# EAGLE design sensor-pod (EAGLE 9.6.2)
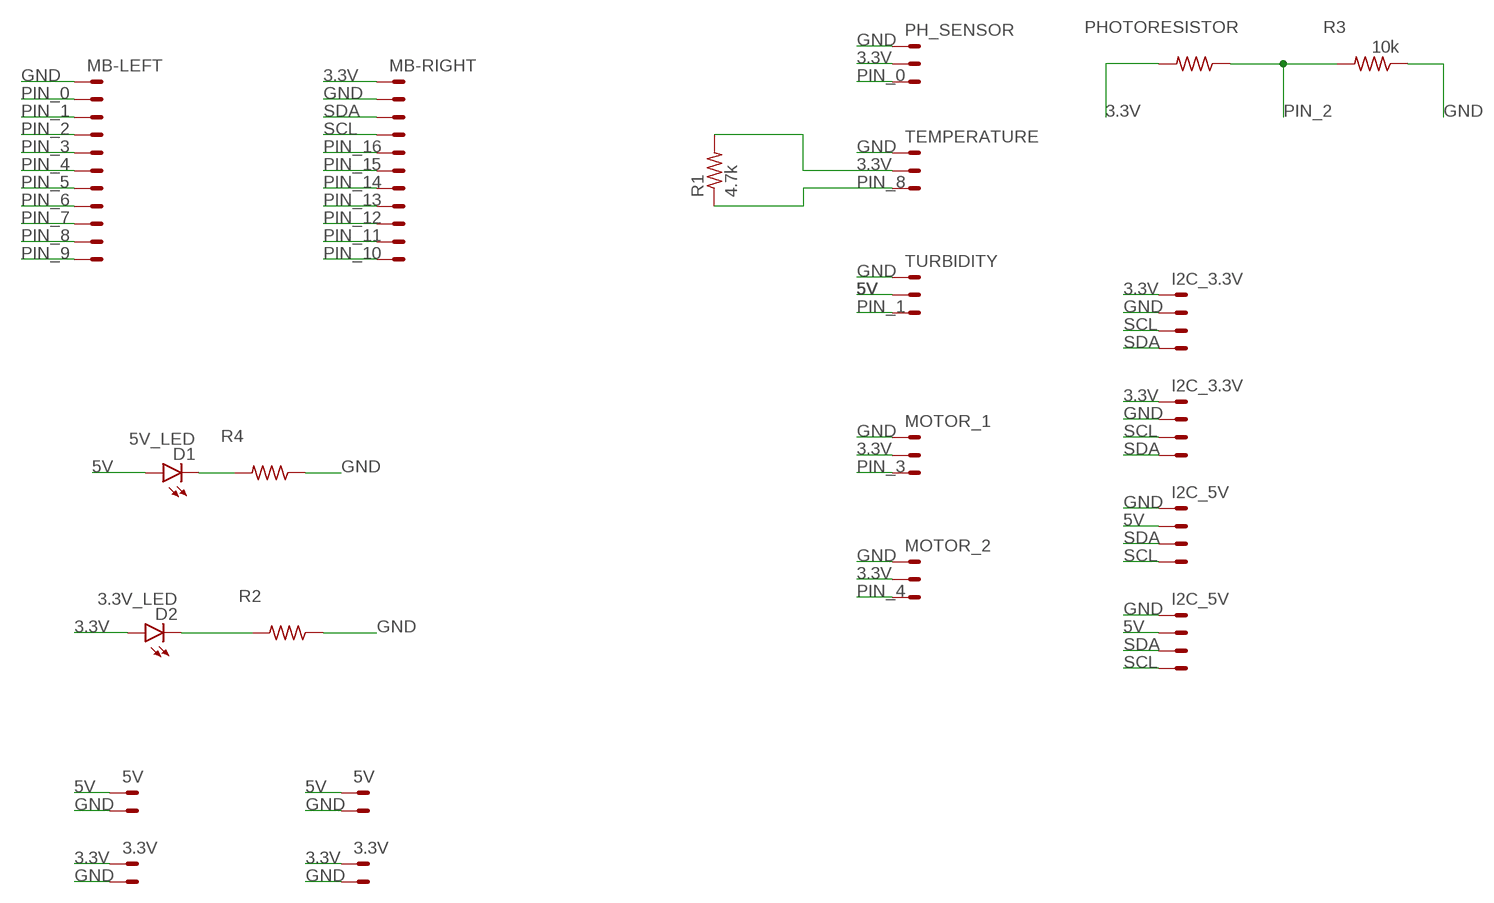
[diagram p0: schematic, sheet 1]

## Parts
1  5V  22-23-2021  [22-23-2021]
D1  5V_LED  SFH482  [SFH482]
D2  3.3V_LED  SFH482  [SFH482]
PHOTORESISTOR  R-US_0204/7  [0204/7]
R1  4.7k  R-US_0204/7  [0204/7]
R2  R-US_0204/7  [0204/7]
R3  10k  R-US_0204/7  [0204/7]
R4  R-US_0204/7  [0204/7]
X1  PH_SENSOR  22-23-2031  [22-23-2031]
X2  I2C_5V  22-23-2041  [22-23-2041]
X3  TURBIDITY  22-23-2031  [22-23-2031]
X4  5V  22-23-2021  [22-23-2021]
X5  TEMPERATURE  22-23-2031  [22-23-2031]
X6  MOTOR_1  22-23-2031  [22-23-2031]
X7  MOTOR_2  22-23-2031  [22-23-2031]
X8  I2C_3.3V  22-23-2041  [22-23-2041]
X9  I2C_3.3V  22-23-2041  [22-23-2041]
X10  I2C_5V  22-23-2041  [22-23-2041]
X11  3.3V  22-23-2021  [22-23-2021]
X12  3.3V  22-23-2021  [22-23-2021]
X15  MB-LEFT  22-23-2111  [22-23-2111]
X16  MB-RIGHT  22-23-2111  [22-23-2111]

## Nets
3.3V: D2.A PHOTORESISTOR.2 R1.2 X1.2 X5.2 X6.2 X7.2 X8.1 X9.1 X11.1 X12.1 X16.1
5V: 1.1 D1.A X2.2 X3.2 X4.1 X10.2
GND: 1.2 R2.1 R3.1 R4.1 X1.1 X2.1 X3.1 X4.2 X5.1 X6.1 X7.1 X8.2 X9.2 X10.1 X11.2 X12.2 X15.1 X16.2
N$1: D1.K(C) R4.2
N$2: D2.K(C) R2.2
PIN_0: X1.3 X15.2
PIN_1: X3.3 X15.3
PIN_2: PHOTORESISTOR.1 R3.2 X15.4
PIN_3: X6.3 X15.5
PIN_4: X7.3 X15.6
PIN_5: X15.7
PIN_6: X15.8
PIN_7: X15.9
PIN_8: R1.1 X5.3 X15.10
PIN_9: X15.11
PIN_10: X16.11
PIN_11: X16.10
PIN_12: X16.9
PIN_13: X16.8
PIN_14: X16.7
PIN_15: X16.6
PIN_16: X16.5
SCL: X2.4 X8.3 X9.3 X10.4 X16.4
SDA: X2.3 X8.4 X9.4 X10.3 X16.3

## Library data of the parts
1 X4 X11 X12 = con-molex:22-23-2021: .100" (2.54mm) Center Header - 2 Pin; MF: MOLEX; MPN: 22-23-2021; OC_FARNELL: 1462926; OC_NEWARK: 25C3832
D1 D2 = led:SFH482: IR LED infrared emitting diode, Infineon
PHOTORESISTOR R1-R4 = rcl:R-US_: RESISTOR, American symbol; SPICEPREFIX: R
X1 X3 X5-X7 = con-molex:22-23-2031: .100" (2.54mm) Center Header - 3 Pin; MF: MOLEX; MPN: 22-23-2031; OC_FARNELL: 1462950; OC_NEWARK: 30C0862
X2 X8-X10 = con-molex:22-23-2041: .100" (2.54mm) Center Header - 4 Pin; MF: MOLEX; MPN: 22-23-2041; OC_FARNELL: 1462920; OC_NEWARK: 38C0355
X15 X16 = con-molex:22-23-2111: .100" (2.54mm) Center Header - 11 Pin; MF: MOLEX; MPN: 22-23-2111; OC_FARNELL: 5388879; OC_NEWARK: 27C9916

## Board
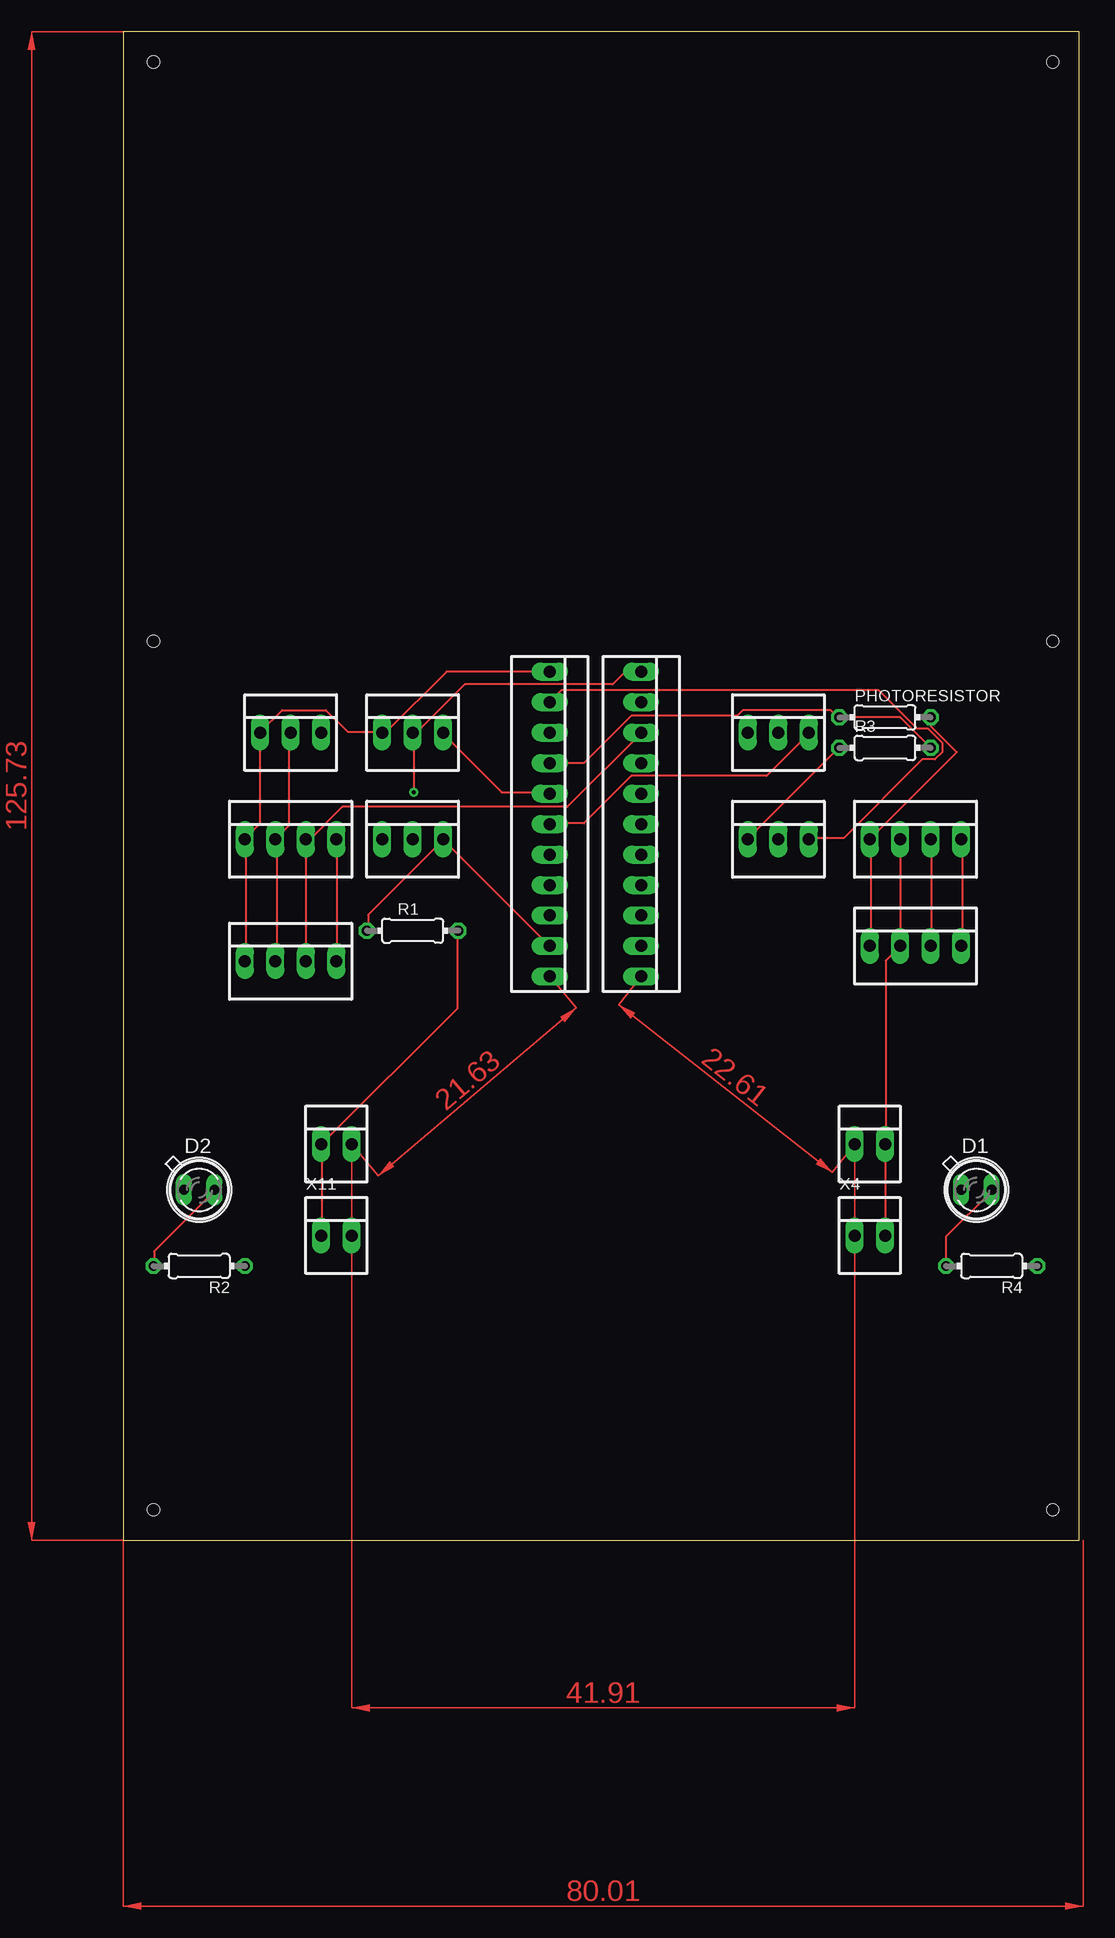
[diagram p1: board, top side]
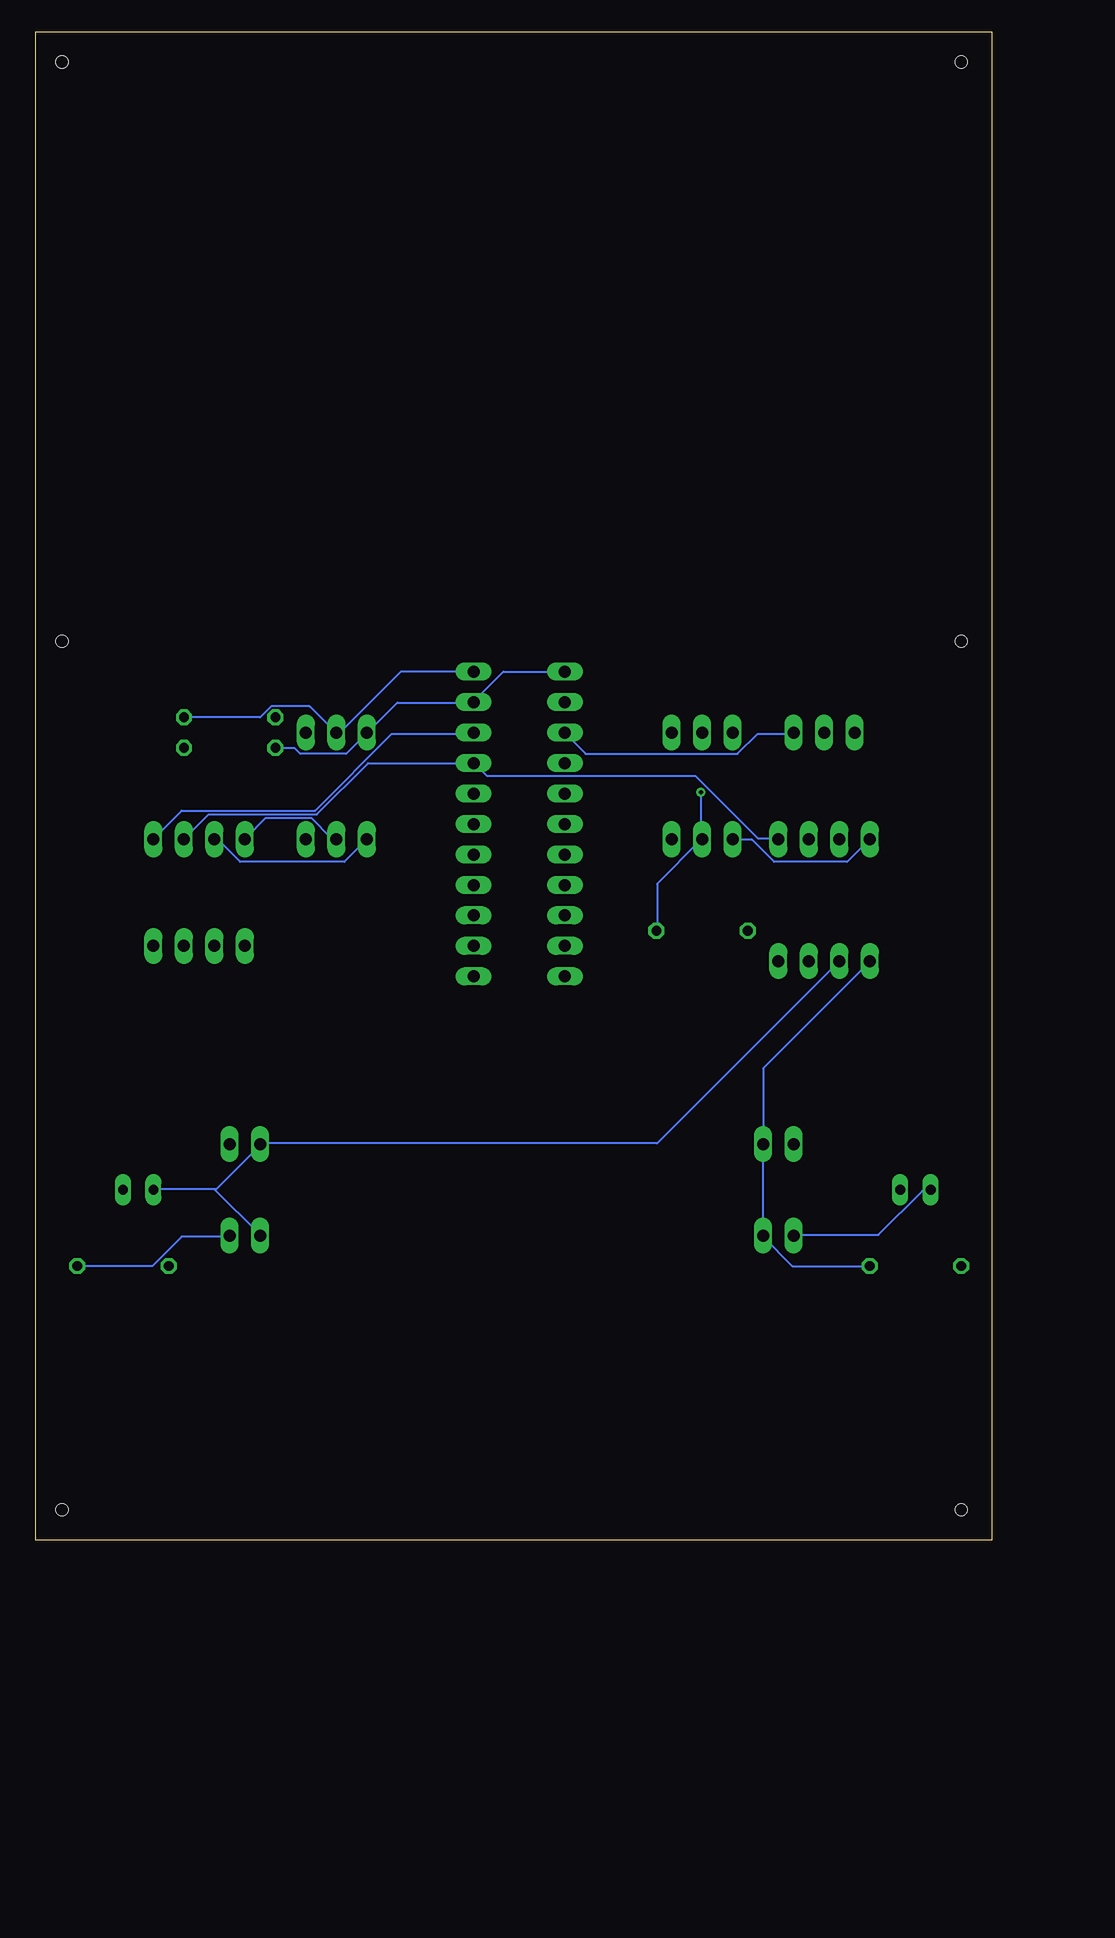
[diagram p2: board, bottom side, seen from below]

Size 79.68 x 125.72 mm. Coordinates in mm from the lower left corner, seen from the top.
Outline: 0,0 79.68,0 79.68,125.72 0,125.72 0,0
Copper layers (1*16): Top 0.035mm / dielectric 1.5mm / Bottom 0.035mm
Design rules "default": minimum track width 6mil, minimum drill 0.35mm, track to track 6mil, track to pad 6mil, pad to pad 6mil, via to via 6mil, smd to smd 6mil, copper to edge 40mil, drill to drill 6mil, minimum pad ring 10mil, minimum via ring 8mil, stop-mask expansion 4mil, vias tented up to drill 0mil, thermal gap 10mil
Holes 1 mm at 2.54,123.19 77.47,123.19 77.47,2.54 2.54,2.54 2.54,74.93 77.47,74.93

### Footprints (pad centres in the part's own frame; a part is rotated, then mirrored left to right if it is on the bottom)
22-23-2021 = drill 1 long: 1 -1.27,0; 2 1.27,0
SFH482 = drill 0.813 long: A -1.27,0; K 1.27,0
0204/7 = drill 0.813 octagon: 1 -3.81,0; 2 3.81,0
22-23-2031 = drill 1 long: 1 -2.54,0; 2 0,0; 3 2.54,0
22-23-2041 = drill 1 long: 1 -3.81,0; 2 -1.27,0; 3 1.27,0; 4 3.81,0
22-23-2111 = drill 1 long: 1 -12.7,0; 2 -10.16,0; 3 -7.62,0; 4 -5.08,0; 5 -2.54,0; 6 0,0; 7 2.54,0; 8 5.08,0; 9 7.62,0; 10 10.16,0; 11 12.7,0

### Placement (x,y rotation side)
1  62.23,33.02 0 top
D1  71.12,29.21 0 top
D2  6.35,29.21 0 top
PHOTORESISTOR  63.5,68.58 0 top
R1  24.13,50.8 0 top
R2  6.35,22.86 180 top
R3  63.5,66.04 0 top
R4  72.39,22.86 180 top
X1  54.61,58.42 0 top
X2  13.97,58.42 0 top
X3  13.97,67.31 0 top
X4  62.23,25.4 0 top
X5  24.13,58.42 0 top
X6  24.13,67.31 0 top
X7  54.61,67.31 0 top
X8  66.04,58.42 0 top
X9  66.04,49.53 0 top
X10  13.97,48.26 0 top
X11  17.78,25.4 0 top
X12  17.78,33.02 0 top
X15  35.56,59.69 270 top
X16  43.18,59.69 270 top

### Tracks (layer width: path | path; a pad name or v marks a point on that pad's centre or on a via)
3.3V  (via drill 0.35)
  Top 0.152: X11.1 16.61,25.45 16.61,32.92 X12.1 16.61,33.07 27.89,44.35 27.89,50.75 R1.2 | PHOTORESISTOR.2 67.36,68.58 67.36,67.82 69.49,65.68 X8.1 62.33,58.37 62.33,49.53 X9.1 | X16.1 41.86,72.39 40.79,71.32 28.5,71.32 24.54,67.36 24.23,67.36 X6.2 24.23,67.21 v24.23,62.33
  Bottom 0.152: R1.2 27.89,50.9 27.89,54.71 24.23,58.37 X5.2 24.23,58.52 v24.23,62.33 | D2.A 5.18,29.11 5.79,29.11 9.45,25.45 16.46,25.45 X11.1 | X1.2 54.71,58.52 55.02,58.52 56.69,60.2 60.5,60.2 62.18,58.52 X8.1 | X16.1 49.23,72.39 54.25,67.36 54.56,67.36 X7.2 54.71,67.36 56.84,69.49 60.05,69.49 60.96,68.58 PHOTORESISTOR.2
5V
  Top 0.152: X10.2 12.8,48.31 12.8,58.37 X2.2 13.87,59.59 13.87,67.21 X3.2
  Bottom 0.152: 64.77,29.26 64.62,29.26 60.96,32.92 1.1 60.96,33.07 27.89,33.07 X10.2 | 64.77,29.26 69.8,29.26 D1.A | 64.77,29.26 60.96,25.45 X4.1
GND
  Top 0.152: X10.1 10.21,48.31 10.21,58.37 X2.1 10.21,58.52 11.43,59.74 X3.1 11.43,67.36 13.26,69.19 16.92,69.19 18.75,67.36 21.49,67.36 X6.1 21.64,67.36 21.95,67.36 26.98,72.39 X15.1 | X4.2 63.55,25.45 63.55,32.92 1.2 63.55,33.07 63.55,48.31 X9.2 X8.2 | X1.1 52.12,58.52 59.59,65.99 R3.1
  Bottom 0.152: R2.1 16.61,22.86 19.05,25.3 X11.2 X12.2 19.05,39.32 10.21,48.16 X10.1 | X2.1 12.04,56.54 18.14,56.54 19.96,58.37 21.49,58.37 X5.1 | R4.1 69.95,22.86 67.51,25.3 63.55,25.3 X4.2 | X15.1 40.69,72.39 43.13,69.95 X16.2 43.28,69.8 49.53,69.8 51.97,67.36 X7.1 52.12,67.21 53.8,65.53 57.61,65.53 58.06,65.99 59.59,65.99 R3.1 | X1.1 53.95,56.54 62.64,56.54 64.47,58.37 64.77,58.37 X8.2
N$1
  Top 0.152: R4.2 68.58,25.3 72.39,29.11 D1.K
N$2
  Top 0.152: R2.2 2.59,22.86 2.59,24.08 7.62,29.11 D2.K
PIN_0
  Top 0.152: X15.2 36.58,70.87 62.94,70.87 66.14,67.67 67.06,67.67 68.28,66.45 68.28,65.68 67.67,65.08 66.6,65.08 60.05,58.52 57.15,58.52 X1.3
PIN_1
  Bottom 0.152: X3.3 16.61,67.21 19.51,67.21 21.18,65.53 33.83,65.53 35.51,67.21 X15.3
PIN_2
  Top 0.152: R3.2 64.77,68.58 PHOTORESISTOR.1 59.59,68.58 58.98,69.19 51.66,69.19 51.21,68.73 42.37,68.73 38.41,64.77 X15.4
PIN_3
  Top 0.152: X15.5 35.51,62.33 31.55,62.33 26.67,67.21 X6.3
PIN_4
  Top 0.152: X15.6 35.66,59.74 38.41,59.74 42.37,63.7 53.65,63.7 57.15,67.21 X7.3
PIN_8
  Top 0.152: 26.67,58.37 20.42,52.12 20.42,50.9 R1.1 | 26.67,58.37 35.51,49.53 X15.10 | 26.67,58.37 X5.3
SCL
  Top 0.152: X10.4 17.83,48.31 17.83,58.37 X2.4 | X9.3 67.36,49.53 67.36,58.37 X8.3
  Bottom 0.152: X8.3 65.23,60.5 56.24,60.5 51.97,64.77 X16.4 43.13,64.77 42.06,63.7 24.69,63.7 19.51,58.52 17.83,58.52 X2.4
SDA
  Top 0.152: X10.3 X2.3 15.24,58.52 15.7,58.52 18.29,61.11 37.03,61.11 43.13,67.21 X16.3 | X9.4 69.95,49.53 69.95,58.37 X8.4
  Bottom 0.152: X16.3 43.28,67.21 49.99,67.21 56.39,60.81 67.51,60.81 69.8,58.52 X8.4
(copper drawn outside any net)
  shapes: Top area x5